# EasyEDA Pro project ProPrj_三轮车_2025-08-24.epro, schematic Schematic3
Board Name: 分线板; Create Date: 2025-01-01; Page Name: P1; Project Name: 三轮车; Schematic Name: Schematic3; Update Date: 2025-01-06; Company: 嘉立创EDA; Page Size: A4; Version: V1.0
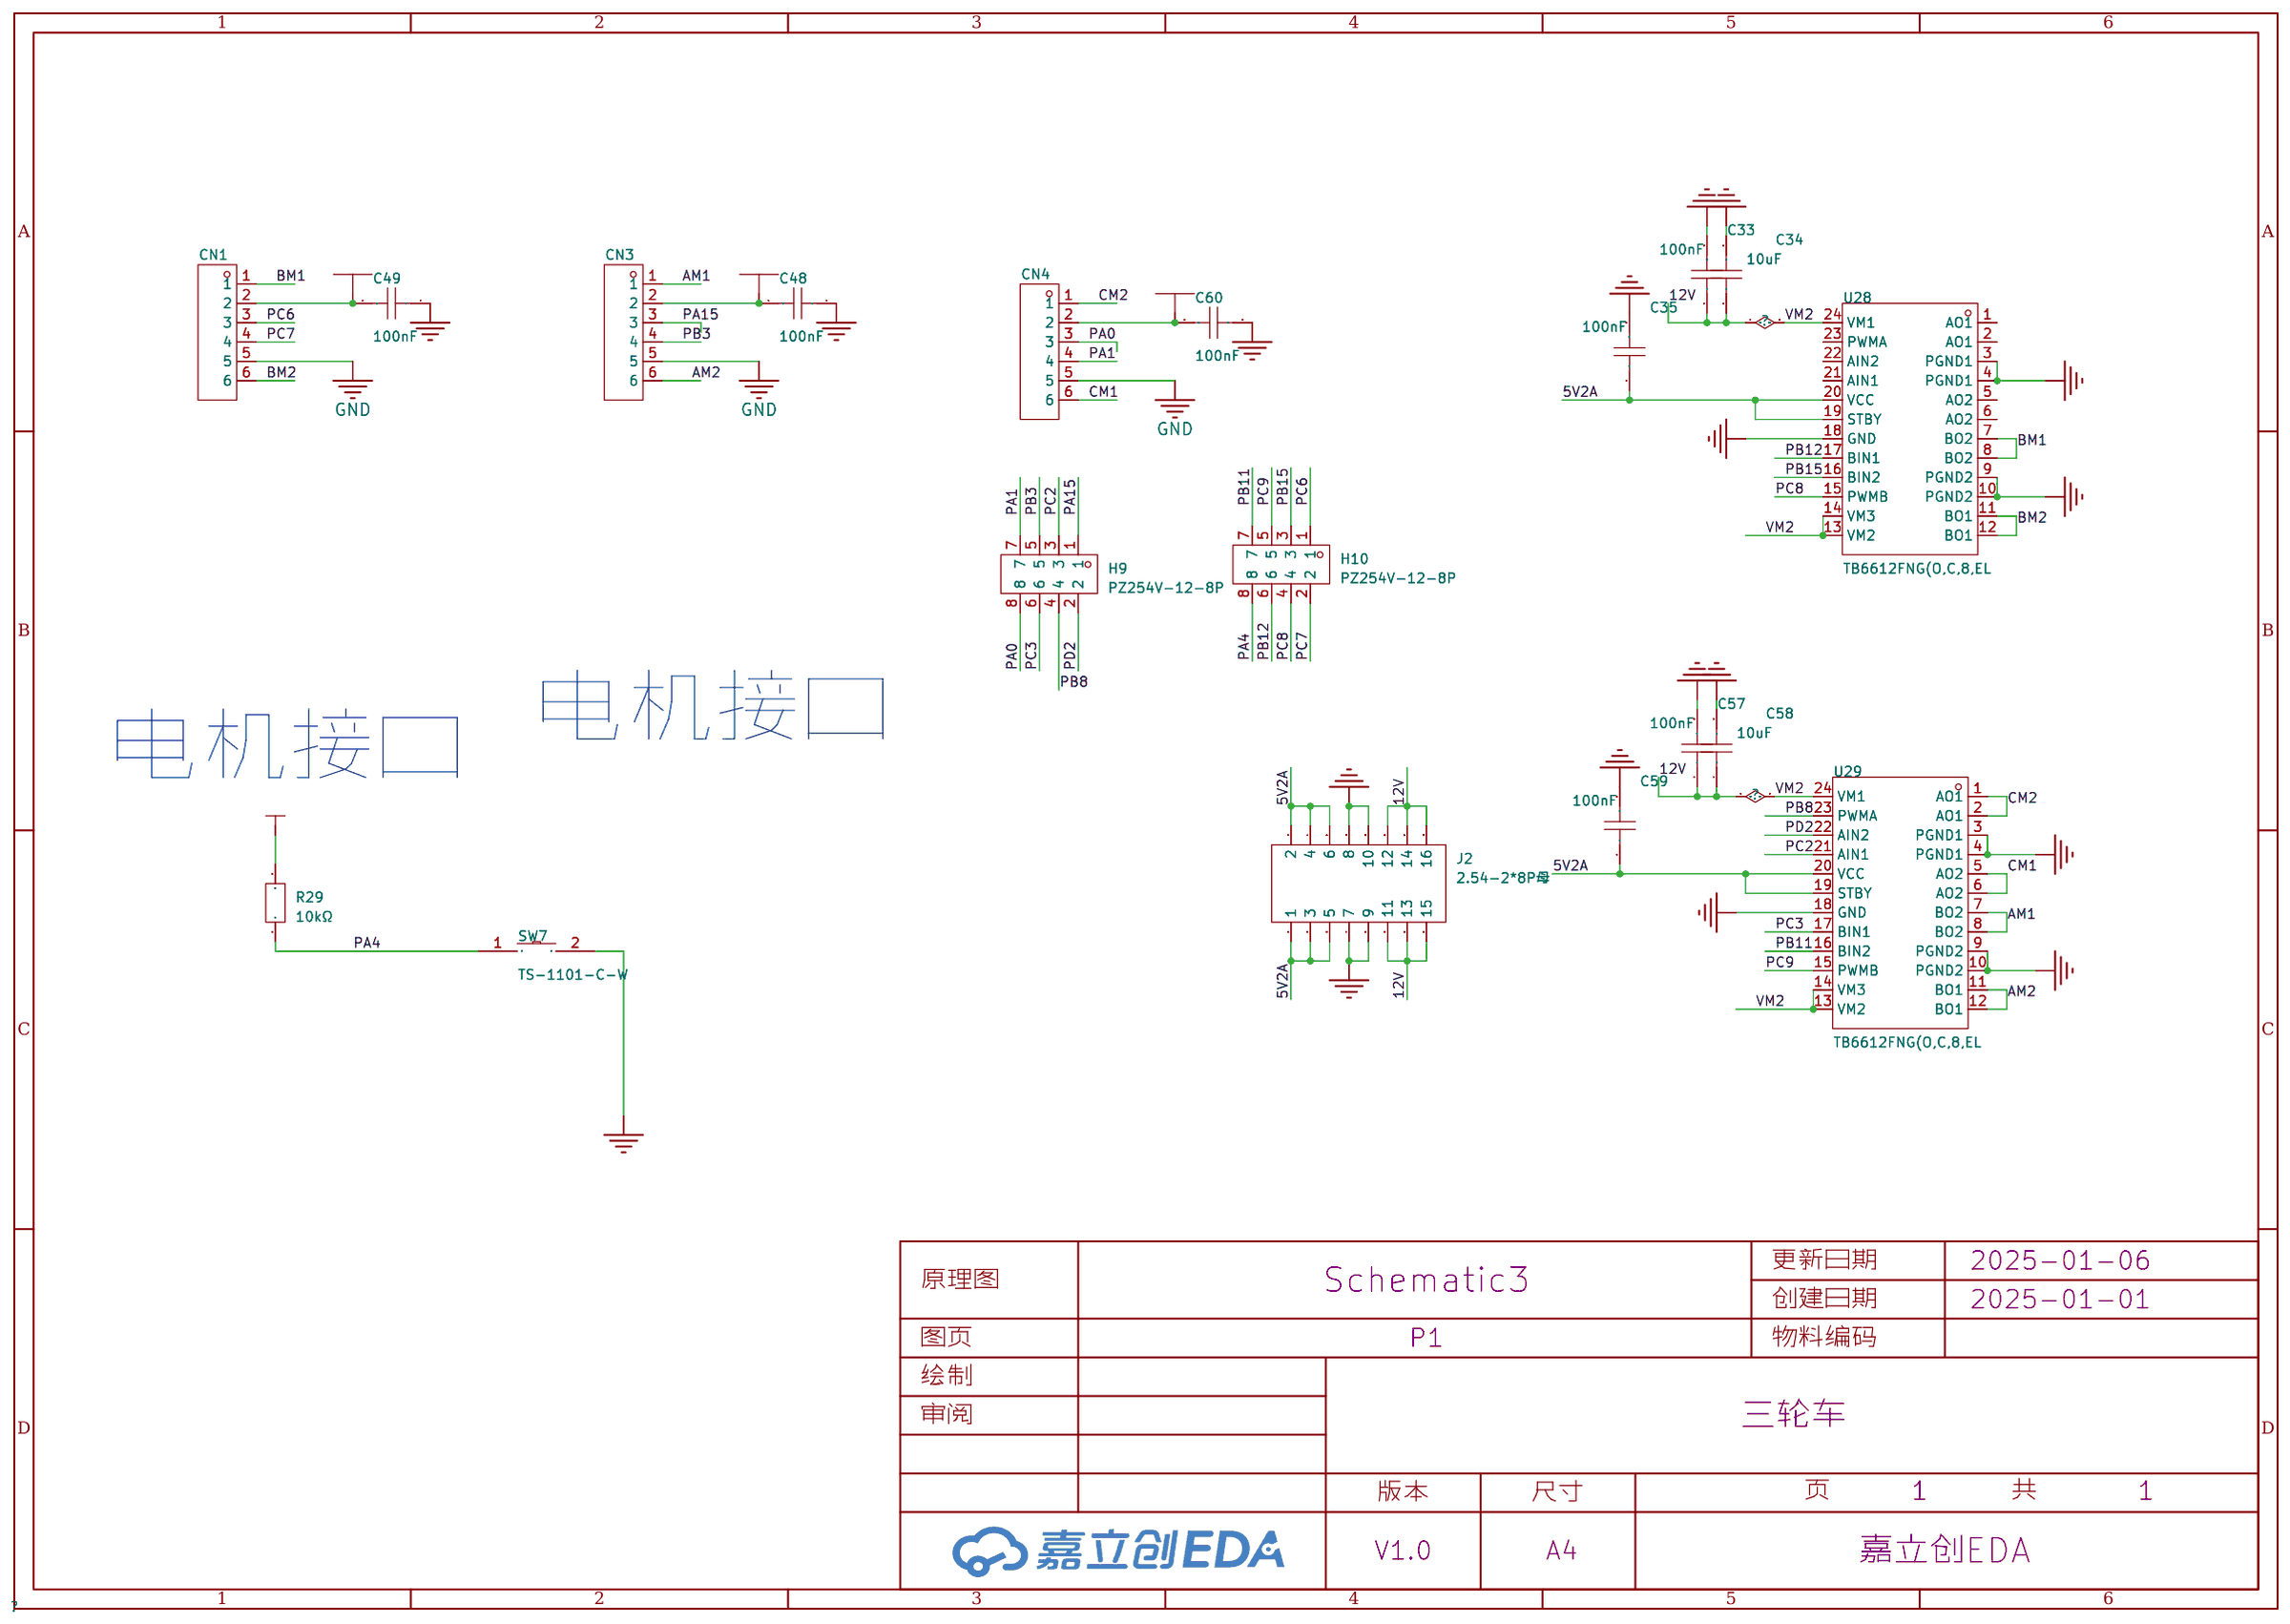
[diagram p4: schematic sheet]

## Parts
C33  100nF  [C0603]
C34  10uF  [C0603]
C35  100nF  [C0603]
C48  100nF  [C0603]
C49  100nF  [C0603]
C57  100nF  [C0603]
C58  10uF  [C0603]
C59  100nF  [C0603]
C60  100nF  [C0603]
CN1  PH2.0-6P  [PH2.0-6P 直针端子座]
CN3  PH2.0-6P  [PH2.0-6P 直针端子座]
CN4  PH2.0-6P  [PH2.0-6P 直针端子座]
H9  PZ254V-12-8P  [HDR-TH_8P-P2.54-V-M-R2-C4-S2.54]
H10  PZ254V-12-8P  [HDR-TH_8P-P2.54-V-M-R2-C4-S2.54]
J2  2.54-2*8P母  [HDR-TH_16P-P2.54-V-F-R2-C8-S2.54]
R29  10kΩ  [R0603]
SW7  TS-1101-C-W  [SW-SMD_L6.0-W3.3-LS8.0]
U28  TB6612FNG(O,C,8,EL  [SSOP-24_L8.4-W5.8-P0.65-LS7.8-BL]
U29  TB6612FNG(O,C,8,EL  [SSOP-24_L8.4-W5.8-P0.65-LS7.8-BL]

## Library data of the parts
C33 C35 C57 C59 = CGA0603X7R104K500JT: 容值:100nF;精度:±10%;额定电压:50V;材质(温度系数):X7R;; LCSC Part Name: 100nF ±10% 50V; Supplier Part: C6119867; Manufacturer: HRE(芯声); Supplier Footprint: 0603; JLCPCB Part Class: 扩展库; Supplier: LCSC; Tolerance: ±10%; Voltage Rated: 50V; Temperature Coefficient: X7R
C34 C58 = CGA0603X5R106K100JT: 容值:10uF;精度:±10%;额定电压:10V;材质(温度系数):X5R;; LCSC Part Name: 10uF ±10% 10V; Supplier Part: C6119842; Manufacturer: HRE(芯声); Supplier Footprint: 0603; JLCPCB Part Class: Extended Part; Supplier: LCSC; Tolerance: ±10%; Voltage Rated: 10V; Temperature Coefficient: X5R
C48 C49 C60 = CC0603KRX7R9BB104: 容值:100nF;精度:±10%;额定电压:50V;材质(温度系数):X7R;; LCSC Part Name: 100nF ±10% 50V; Supplier Part: C14663; Manufacturer: YAGEO(国巨); Supplier Footprint: 0603; JLCPCB Part Class: Basic Part; Datasheet: https://atta.szlcsc.com/upload/public/pdf/source/20180910/C282072_33301C7F631E79921B82A8DAC6BCC5B3.pdf; Supplier: LCSC; Tolerance: ±10%; Voltage Rated: 50V; Temperature Coefficient: X7R
CN1 CN3 CN4 = PH2.0-6P: Pin Type: IN; Supplier: LCSC; Supplier Part: C722763; Manufacturer: CAX(创都); Manufacturer Part: PH2.0-4P; JLCPCB Part Class: Extended Part
H9 H10 = PZ254V-12-8P: 插针结构:2x4P;间距:2.54mm;行距:2.54mm;圆针/方针:方针;安装类型:直插;排数:双排;总PIN位数:8P;额定电流:-;额定电压:-;配合针长度:6mm;塑高:2.5mm;端接针长度:3mm;触头材质:黄铜;触头镀层:-;工作温度范围:-40℃~+105℃;颜色:黑色;; LCSC Part Name: 间距:2.54mm 2x4P 直插 方针; Supplier Part: C492421; Manufacturer: XFCN(兴飞); Supplier Footprint: 插件,P=2.54mm; JLCPCB Part Class: 扩展库; Datasheet: https://atta.szlcsc.com/upload/public/pdf/source/20200309/C492421_DC8A206AF99CD7755BD4A5B0BC48200B.pdf; Supplier: LCSC; Pin Structure: 2x4P; Pitch: 2.54mm; Row Spacing: 2.54mm; Circluar Pins/Square Pins: 方针; Mounting Type: 直插; Number of Rows: 双排; Number of Pins: 8P; Length of Mating Pin: 6mm; Insulation Height: 2.5mm; Length of End Connection Pin: 3mm; Contact Material: 黄铜; Operating Temperature Range: -40℃~+105℃; Color: 黑色
J2 = 2.54-2*8P母: 插孔结构:2x8P;间距:2.54mm;行距:2.54mm;安装类型:直插;排数:双排;总孔位数:16P;塑高:-;触头材质:黄铜;触头镀层:-;; LCSC Part Name: 间距:2.54mm 2x8P 直插; Supplier Part: C30734; Manufacturer: BOOMELE(博穆精密); Supplier Footprint: 插件,P=2.54mm; JLCPCB Part Class: 扩展库; Datasheet: https://atta.szlcsc.com/upload/public/pdf/source/20230817/400B44B2F3F98035DBB6B63900A9163B.pdf; Supplier: LCSC; Holes Structure: 2x8P; Pitch: 2.54mm; Row Spacing: 2.54mm; Mounting Type: 直插; Number of Rows: 双排; Number of Holes: 16P; Contact Material: 黄铜
R29 = FRC0603J103TS: 电阻类型:厚膜电阻;阻值:10kΩ;精度:±5%;功率:100mW;最大工作电压:75V;温度系数:±100ppm/℃;; LCSC Part Name: 10kΩ ±5% 100mW 厚膜电阻; Supplier Part: C2930027; Manufacturer: FOJAN(富捷); Supplier Footprint: 0603; JLCPCB Part Class: 扩展库; Datasheet: https://atta.szlcsc.com/upload/public/pdf/source/20211221/925EC7D7225764EE0046F22065062C87.pdf; Supplier: LCSC; Type: 厚膜电阻; Tolerance: ±5%; Power(Watts): 100mW; Overload Voltage (Max): 75V; Temperature Coefficient: ±100ppm/℃; Operating Temperature Range: -55℃~+155℃
SW7 = TS-1101-C-W: 电路结构:单刀单掷;按钮形状:矩形按钮;作用力:260gf;安装方式:立贴;开关长度:6mm;开关宽度:3.6mm;开关高度:2.5mm;带支架:不带;触点电流:50mA;额定电压(AC):-;额定电压(DC):12V;额定功率:-;绝缘电阻:-;带灯:无;机械寿命:5万次;; LCSC Part Name: 6*3.6*2.5mm 立贴 轻触开关; Supplier Part: C318938; Manufacturer: XKB Connectivity(中国星坤); Supplier Footprint: SMD; JLCPCB Part Class: 扩展库; Datasheet: https://atta.szlcsc.com/upload/public/pdf/source/20200227/C318938_C2E53B1EEDE37D980A33616AC086DE53.pdf; Supplier: LCSC; Circuit: 单刀单掷; Actuator Style: 矩形按钮; Operating Force: 260gf; Mounting Style: 立贴; Switch Length: 6mm; Switch Width: 3.6mm; Switch Height: 2.5mm; Strike Gundam: 不带; Contact Current: 50mA; Voltage Rating (DC): 12V; Actuator/Cap Color: 白色带淡绿; With Lamp: 无; Mechanical Life: 5万次; Operating Temperature: -30℃~+85℃
U28 U29 = TB6612FNG(O,C,8,EL: 双直流电机驱动器集成电路; Supplier Part: C88224; Manufacturer: TOSHIBA(东芝); Supplier Footprint: SSOP-24-208mil; JLCPCB Part Class: 扩展库; Datasheet: https://atta.szlcsc.com/upload/public/pdf/source/20171128/C141517_15118625624231147036.pdf; Supplier: LCSC

## Nets
5V2A: C35.1 C48.2 C49.2 C59.1 C60.2 CN1.2 CN3.2 CN4.2 J2.1 J2.2 J2.3 J2.4 J2.5 J2.6 R29.2 U28.19(STBY) U28.20(VCC) U29.19(STBY) U29.20(VCC)
12V: C33.1 C34.1 C57.1 C58.1 J2.11 J2.12 J2.13 J2.14 J2.15 J2.16 U28.13(VM2) U28.14(VM3) U28.24(VM1) U29.13(VM2) U29.14(VM3) U29.24(VM1)
GND: C33.2 C34.2 C35.2 C48.1 C49.1 C57.2 C58.2 C59.2 C60.1 CN1.5 CN3.5 CN4.5 J2.7 J2.8 J2.9 J2.10 SW7.2 U28.3(PGND1) U28.4(PGND1) U28.9(PGND2) U28.10(PGND2) U28.18(GND) U29.3(PGND1) U29.4(PGND1) U29.9(PGND2) U29.10(PGND2) U29.18(GND)
AM1: CN3.1 U29.7(BO2) U29.8(BO2)
AM2: CN3.6 U29.11(BO1) U29.12(BO1)
BM1: CN1.1 U28.7(BO2) U28.8(BO2)
BM2: CN1.6 U28.11(BO1) U28.12(BO1)
CM1: CN4.6 U29.5(AO2) U29.6(AO2)
CM2: CN4.1 U29.1(AO1) U29.2(AO1)
PA0: CN4.3 H9.8
PA1: CN4.4 H9.7
PA4: H10.8 R29.1 SW7.1
PA15: CN3.3 H9.1
PB3: CN3.4 H9.5
PB8: H9.4 U29.23(PWMA)
PB11: H10.7 U29.16(BIN2)
PB12: H10.6 U28.17(BIN1)
PB15: H10.3 U28.16(BIN2)
PC2: H9.3 U29.21(AIN1)
PC3: H9.6 U29.17(BIN1)
PC6: CN1.3 H10.1
PC7: CN1.4 H10.2
PC8: H10.4 U28.15(PWMB)
PC9: H10.5 U29.15(PWMB)
PD2: H9.2 U29.22(AIN2)

Not connected (* = marked no-connect by the designer): U28 1(AO1) 2(AO1) 5(AO2) 6(AO2) 21(AIN1) 22(AIN2) 23(PWMA)

## Notes on the sheet
- 电机接口
- 电机接口
